# Altium project WG-JW-MB.PrjPCB
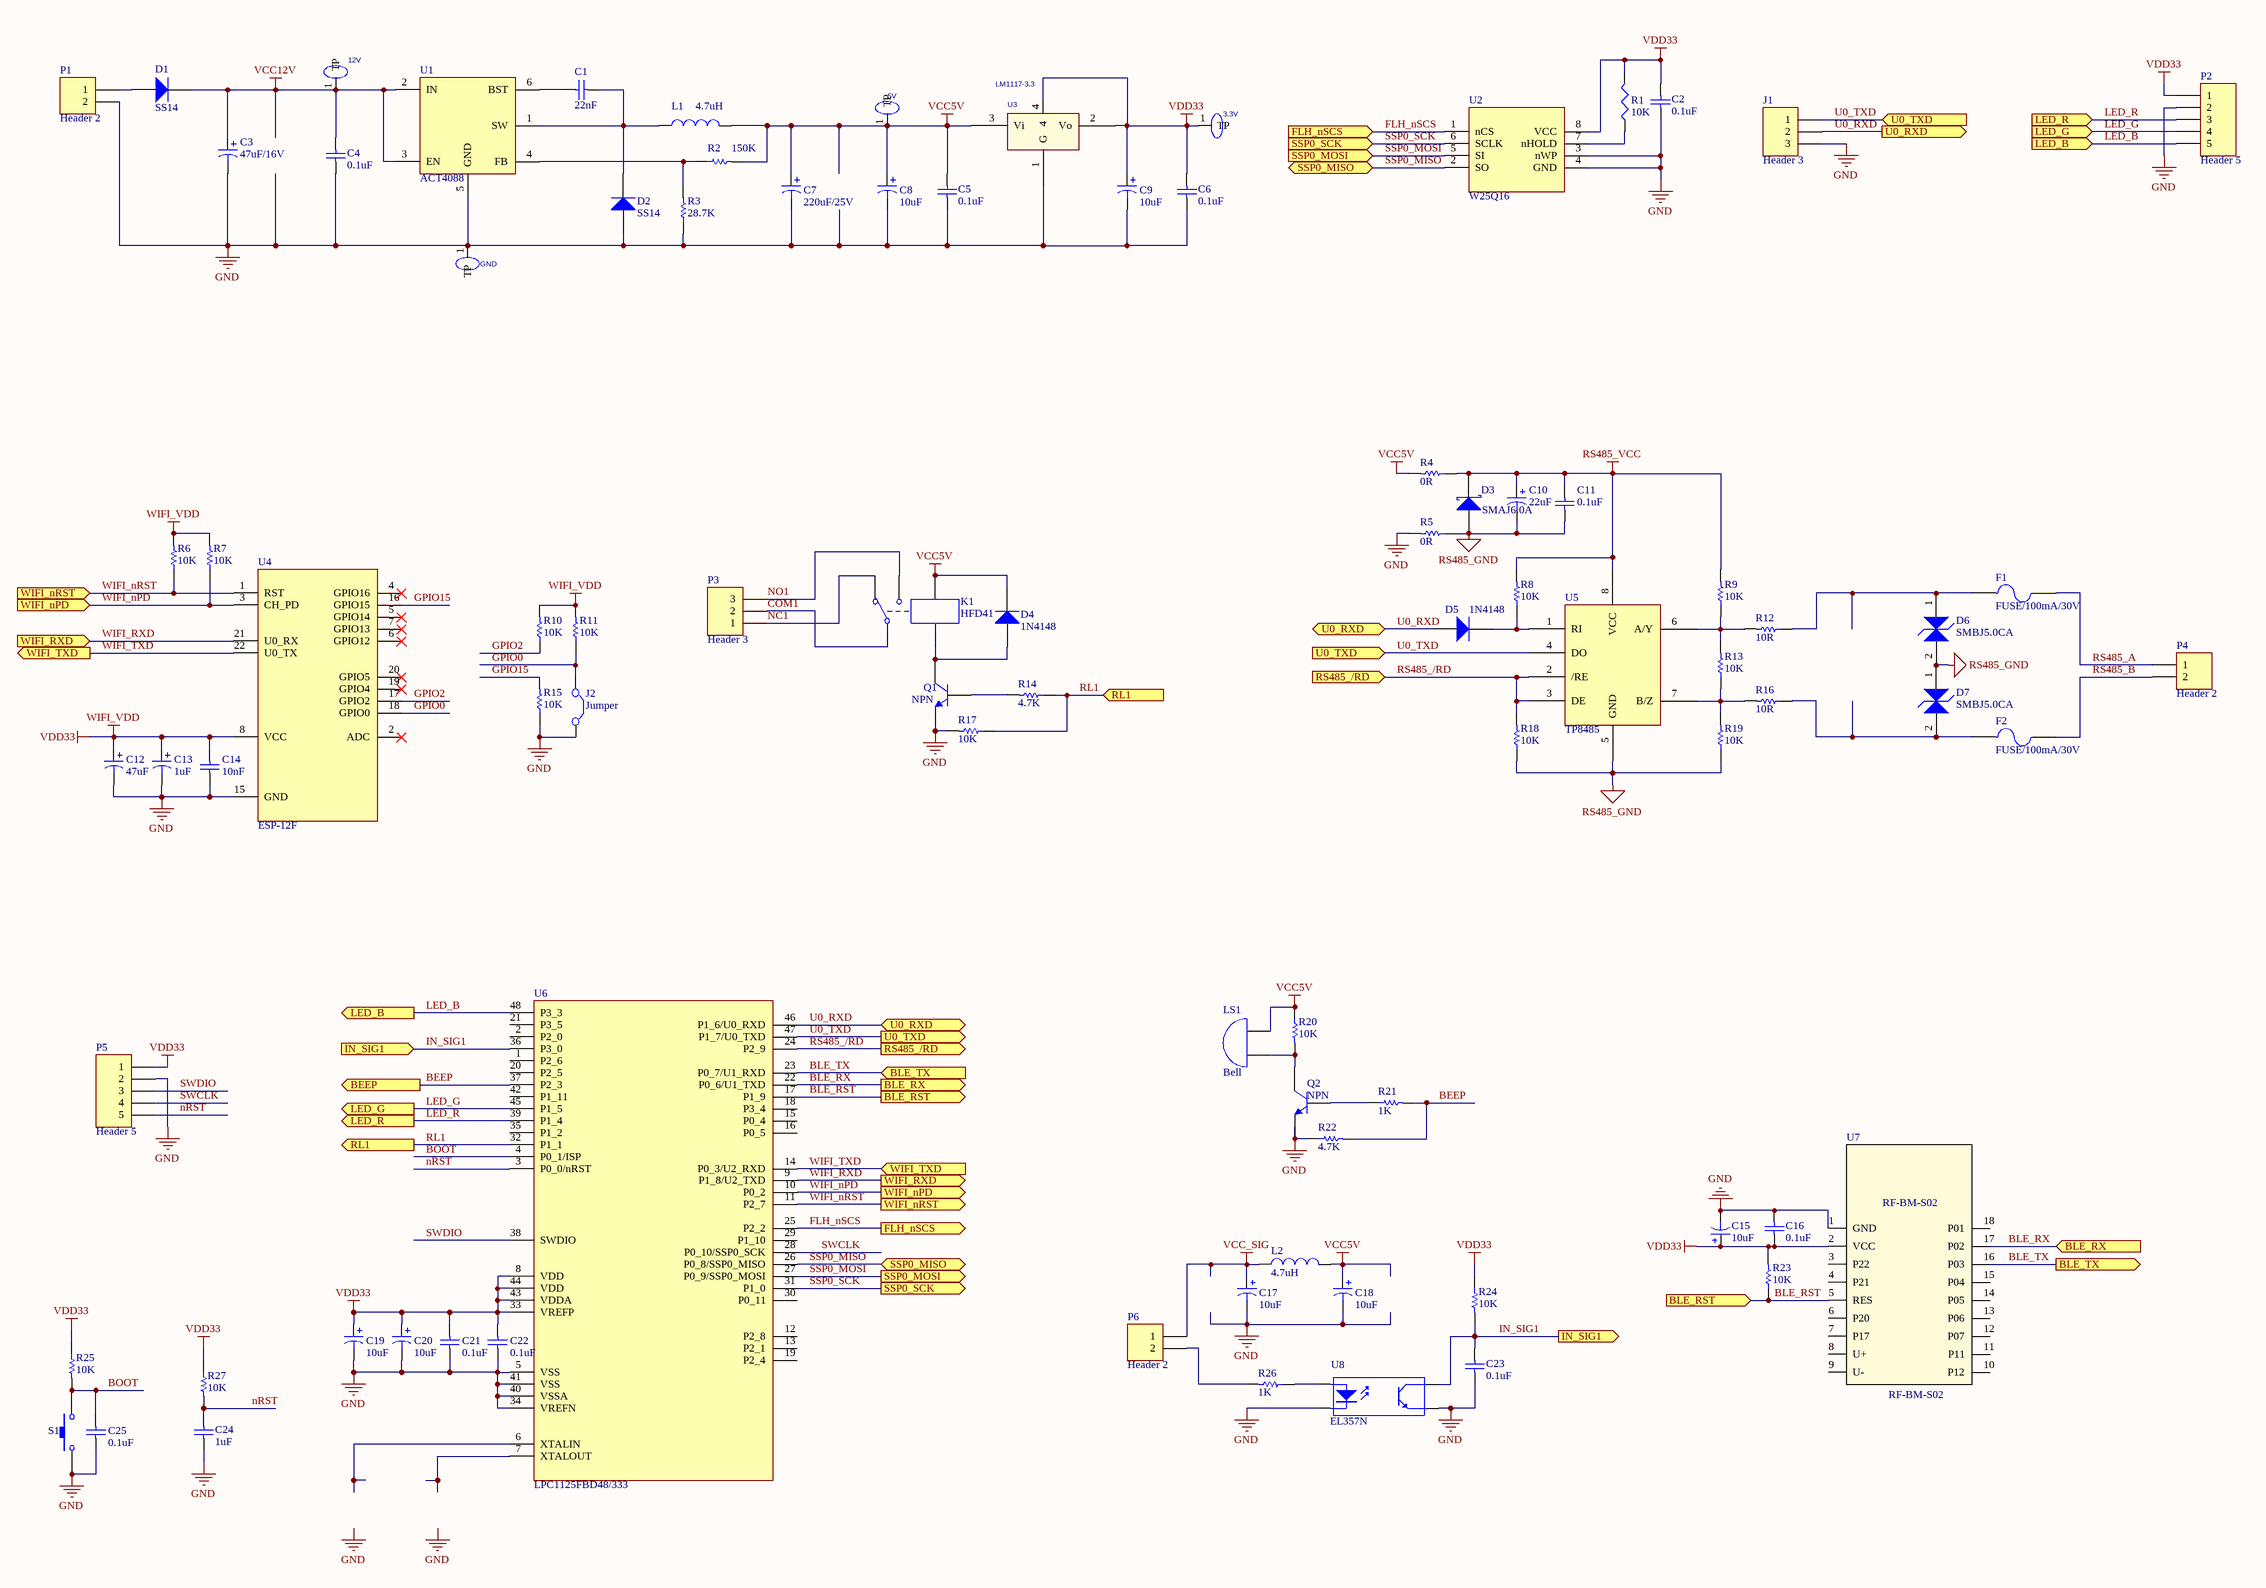
[diagram p0: WG-JW-MB.SchDoc]
1 sheet, 88 parts. Net scope: flat (ports and power ports of the same name join across sheets).
Board file: WG-JW-MB V1.0.PcbDoc

## Sheet WG-JW-MB.SchDoc
size C

### Parts
3.3V  5VOUT  [TestPoint]  (value not drawn)
5V  5VOUT  [TestPoint]  (value not drawn)
12V  5VOUT  [TestPoint]  (value not drawn)
C1  22nF  [0805 - C]
C2  0.1uF  [0805 - C]
C3  47uF/16V  [smd_ec_d5.2]
C4  0.1uF  [0805 - C]
C5  0.1uF  [0805 - C]
C6  0.1uF  [0805 - C]
C7  220uF/25V  [smd_ec_d8]
C8  10uF  [0805 - C]
C9  10uF  [0805 - C]
C10  22uF  [0805 - C]
C11  0.1uF  [0805 - C]
C12  47uF  [SMD_EC_D5.2]
C13  1uF  [0805 - C]
C14  10nF  [0805 - C]
C15  10uF  [0805 - C]
C16  0.1uF  [0805 - C]
C17  10uF  [0805 - C]
C18  10uF  [0805 - C]
C19  10uF  [0805 - C]
C20  10uF  [0805 - C]
C21  0.1uF  [0805 - C]
C22  0.1uF  [0805 - C]
C23  0.1uF  [0805 - C]
C24  1uF  [0805 - C]
C25  0.1uF  [0805 - C]
D1  SS14  [SMD_DIODE_SMA]
D2  SS14  [SMD_DIODE_SMA]
D3  SMAJ6.0A  [SMAJ_A]
D4  1N4148  [1n4148]
D5  1N4148  [1n4148]
D6  SMBJ5.0CA  [SMBJ_CA]
D7  SMBJ5.0CA  [SMBJ_CA]
F1  FUSE/100mA/30V  [SMD_POLYSWITCH]
F2  FUSE/100mA/30V  [SMD_POLYSWITCH]
GND  5VOUT  [TestPoint]  (value not drawn)
J1  Header 3  [HDR1X3]
J2  Jumper  [HDR1X2]
K1  HFD41  [HFD23]
L1  4.7uH  [SMD_L_3015]
L2  4.7uH  [SMD_L_3015]
LS1  Bell  [BZ_D12]
P1  Header 2  [CON2-5.08]
P2  Header 5  [CN_1X5_P200]
P3  Header 3  [CN_1X3_P200]
P4  Header 2  [cn_1x2_p200]
P5  Header 5  [CN_1X5_P200]
P6  Header 2  [CN_1X2_P200]
Q1  NPN  [SOT23]
Q2  NPN  [SOT23]
R1  10K  [0805 - R]
R2  150K  [0805 - R]
R3  28.7K  [0805 - R]
R4  0R  [0805 - R]
R5  0R  [0805 - R]
R6  10K  [0805 - R]
R7  10K  [0805 - R]
R8  10K  [0805 - R]
R9  10K  [0805 - R]
R10  10K  [0805 - R]
R11  10K  [0805 - R]
R12  10R  [0805 - R]
R13  10K  [0805 - R]
R14  4.7K  [0805 - R]
R15  10K  [0805 - R]
R16  10R  [0805 - R]
R17  10K  [0805 - R]
R18  10K  [0805 - R]
R19  10K  [0805 - R]
R20  10K  [0805 - R]
R21  1K  [0805 - R]
R22  4.7K  [0805 - R]
R23  10K  [0805 - R]
R24  10K  [0805 - R]
R25  10K  [0805 - R]
R26  1K  [0805 - R]
R27  10K  [0805 - R]
S1  SW-PB  [SW_SMD_2P]  (value not drawn)
U1  ACT4088  [SOT23-6]
U2  W25Q16  [SOIC8-50X204]
U3  LM1117-3.3  [SOT223]
U4  ESP-12F  [WIFI-ESP]
U5  TP8485  [SOIC8-50X204]
U6  LPC1125FBD48/333  [TQFP48]
U7  RF-BM-S02  [RF-BM-S02]
U8  EL357N  [SOP4]

### Ports
BEEP (out), BLE_RST (in), BLE_RST (out), BLE_RX (in), BLE_RX (out), BLE_TX (in), BLE_TX (out), FLH_nSCS (in), FLH_nSCS (out), IN_SIG1 (in), IN_SIG1 (out), LED_B (in), LED_B (out), LED_G (in), LED_G (out), LED_R (in), LED_R (out), RL1 (in), RL1 (out), RS485_/RD (in), RS485_/RD (out), SSP0_MISO, SSP0_MOSI (in), SSP0_MOSI (out), SSP0_SCK (in), SSP0_SCK (out), U0_RXD, U0_RXD (out), U0_TXD (in), U0_TXD (out), WIFI_nPD (in), WIFI_nPD (out), WIFI_nRST (in), WIFI_nRST (out), WIFI_RXD (in), WIFI_RXD (out), WIFI_TXD (in), WIFI_TXD (out)

### Nets
GND: C2.1 C3.2 C4.1 C5.1 C6.1 C7.2 C8.2 C9.2 C12.2 C13.2 C14.1 C15.2 C16.2 C17.2 C18.2 C19.2 C20.2 C21.1 C22.1 C23.1 C24.1 C25.1 D2.1(A) GND.1(TP) J1.3 J2.2(C2) P1.2 P2.2 P5.2 Q1.3(E) Q2.3(E) R3.1 R5.2 R15.1 R17.2 R22.1 S1.1 U1.5(GND) U2.3(nWP) U2.4(GND) U3.1(G) U4.15(GND) U6.5(VSS) U6.34(VREFN) U6.40(VSSA) U6.41(VSS) U7.1(GND) U8.2(K) U8.3(E)
RS485_GND: C10.2 C11.2 D3.1(A) D6.2 D7.1 R5.1 R18.1 R19.1 U5.5(GND)
RS485_VCC: C10.1 C11.1 D3.2(K) R4.1 R8.2 R9.2 U5.8(VCC)
VCC5V: 5V.1(TP) C5.2 C7.1 C8.1 C18.1 D4.2(K) K1.5 L1.2 L2.2 LS1.1(A) R2.2 R4.2 R20.1 U3.3(Vi)
VCC12V: 12V.1(TP) C3.1 C4.2 D1.2(K) U1.2(IN) U1.3(EN)
VCC_SIG: C17.1 L2.1 P6.1
VDD33: 3.3V.1(TP) C2.2 C6.2 C9.1 C12.1 C13.1 C14.2 C15.1 C16.1 C19.1 C20.1 C21.2 C22.2 P2.1 P5.1 R1.2 R6.2 R7.2 R10.2 R11.2 R23.2 R24.1 R25.1 R27.1 U2.8(VCC) U3.2(Vo) U3.4 U4.8(VCC) U6.8(VDD) U6.33(VREFP) U6.43(VDDA) U6.44(VDD) U7.2(VCC)  [also labelled WIFI_VDD]
BEEP: R21.2 R22.2 U6.37(P2_3) ; port BEEP
BLE_RST: R23.1 U6.17(P1_9) U7.5(RES) ; port BLE_RST
BLE_RX: U6.22(P0_6/U1_TXD) U7.17(P02) ; port BLE_RX
BLE_TX: U6.23(P0_7/U1_RXD) U7.16(P03) ; port BLE_TX
BOOT: C25.2 R25.2 S1.2 U6.4(P0_1/ISP)
COM1: K1.1 P3.2
FLH_nSCS: U2.1(nCS) U6.25(P2_2) ; port FLH_nSCS
GPIO0: J2.1(C1) R11.1 U4.18(GPIO0)
GPIO2: R10.1 U4.17(GPIO2)
GPIO15: R15.2 U4.16(GPIO15)
IN_SIG1: C23.2 R24.2 U6.36(P3_0) U8.4(C) ; port IN_SIG1
LED_B: P2.5 U6.48(P3_3) ; port LED_B
LED_G: P2.4 U6.45(P1_5) ; port LED_G
LED_R: P2.3 U6.39(P1_4) ; port LED_R
NC1: K1.2 P3.1
NO1: K1.3 P3.3
nRST: C24.2 P5.5 R27.2 U6.3(P0_0/nRST)
RL1: R14.1 R17.1 U6.32(P1_1) ; port RL1
RS485_/RD: R18.2 U5.2(/RE) U5.3(DE) U6.24(P2_9) ; port RS485_/RD
RS485_A: F1.2 P4.1
RS485_B: F2.2 P4.2
SSP0_MISO: U2.2(SO) U6.26(P0_8/SSP0_MISO) ; port SSP0_MISO
SSP0_MOSI: U2.5(SI) U6.27(P0_9/SSP0_MOSI) ; port SSP0_MOSI
SSP0_SCK: U2.6(SCLK) U6.31(P1_0) ; port SSP0_SCK
SWCLK: P5.4 U6.28(P0_10/SSP0_SCK)
SWDIO: P5.3 U6.38(SWDIO)
U0_RXD: D5.1(A) J1.2 U6.46(P1_6/U0_RXD) ; port U0_RXD
U0_TXD: J1.1 U5.4(DO) U6.47(P1_7/U0_TXD) ; port U0_TXD
WIFI_nPD: R7.1 U4.3(CH_PD) U6.10(P0_2) ; port WIFI_nPD
WIFI_nRST: R6.1 U4.1(RST) U6.11(P2_7) ; port WIFI_nRST
WIFI_RXD: U4.21(U0_RX) U6.9(P1_8/U2_TXD) ; port WIFI_RXD
WIFI_TXD: U4.22(U0_TX) U6.14(P0_3/U2_RXD) ; port WIFI_TXD
NetC1_1: C1.1 D2.2(K) L1.1 U1.1(SW)
NetC1_2: C1.2 U1.6(BST)
NetD1_1: D1.1(A) P1.1
NetD4_1: D4.1(A) K1.4 Q1.1(C)
NetD5_2: D5.2(K) R8.1 U5.1(RI)
NetD6_1: D6.1 F1.1 R12.1
NetD7_2: D7.2 F2.1 R16.1
NetLS1_2: LS1.2(B) Q2.1(C) R20.2
NetP6_2: P6.2 R26.2
NetQ1_2: Q1.2(B) R14.2
NetQ2_2: Q2.2(B) R21.1
NetR1_1: R1.1 U2.7(nHOLD)
NetR2_1: R2.1 R3.2 U1.4(FB)
NetR9_1: R9.1 R12.2 R13.2 U5.6(A/Y)
NetR13_1: R13.1 R16.2 R19.2 U5.7(B/Z)
NetR26_1: R26.1 U8.1(A)

Not connected (* = marked no-connect by the designer): U4 2(ADC)* 4(GPIO16)* 5(GPIO14)* 6(GPIO12)* 7(GPIO13)* 19(GPIO4)* 20(GPIO5)*; U6 1(P2_6) 2(P2_0) 6(XTALIN) 7(XTALOUT) 12(P2_8) 13(P2_1) 15(P0_4) 16(P0_5) 18(P3_4) 19(P2_4) 20(P2_5) 21(P3_5) 29(P1_10) 30(P0_11) 35(P1_2) 42(P1_11); U7 3(P22) 4(P21) 6(P20) 7(P17) 8(U+) 9(U-) 10(P12) 11(P11) 12(P07) 13(P06) 14(P05) 15(P04) 18(P01)

### Notes on the sheet
- Labels drawn without touching a wire or pin: GND

### Library data of the parts
3.3V 5V 12V GND = TESTPOINT
C1 C2 C4-C6 C11 C14 C16 C21-C25 = Cap: Capacitor; Value: 100pF; Published: 8-Jun-2000; LatestRevisionDate: 17-Jul-2002; LatestRevisionNote: Re-released for DXP Platform.; PackageReference: RAD-0.3; Publisher: Altium Limited; PackageDescription: Radial Cap, Thru-Hole; 2 Leads; 0.3 in Pin Spacing
C3 C7-C10 C12 C13 C15 C17-C20 = Cap Pol1: Polarized Capacitor (Radial); Value: 100pF; Published: 8-Jun-2000; LatestRevisionDate: 17-Jul-2002; LatestRevisionNote: Re-released for DXP Platform.; PackageReference: RB7.6-15; Publisher: Altium Limited; PackageDescription: Polarized Capacitor (Radial); 2 Leads
D1 D2 D4 D5 = Diode: Default Diode; Published: 8-Jun-2000; LatestRevisionDate: 17-Jul-2002; LatestRevisionNote: Re-released for DXP Platform.; PackageVersion: Sep-1996; PackageReference: SMC; Publisher: Altium Limited; PackageDescription: DO-214-AB/SMC; 2 C-Bend Leads; Body 7.9 x 5.9 mm, inc. leads (LxW); Code_JEDEC: DO-214-AB
D3 = D Schottky: Schottky Diode; Published: 8-Jun-2000; LatestRevisionDate: 17-Jul-2002; LatestRevisionNote: Re-released for DXP Platform.; PackageReference: SMB; Publisher: Altium Limited; PackageDescription: DO-214-AA/SMB; 2 C-Bend Leads; Body 5.3 x 3.6 mm, inc. leads (LxW); Code_JEDEC: DO-214-AA
D6 D7 = TVS
F1 F2 = Fuse 2: Fuse; Published: 8-Jun-2000; LatestRevisionDate: 17-Jul-2002; LatestRevisionNote: Re-released for DXP Platform.; PackageReference: PIN-W2/E2.8; Publisher: Altium Limited; PackageDescription: Thru-Hole; 2 Leads
J1 P3 = Header 3: Header, 3-Pin; LatestRevisionDate: 17-Jul-2002; LatestRevisionNote: Re-released for DXP Platform.; Publisher: Altium Limited
J2 = Jumper: Jumper Wire; Published: 24-Mar-1999; LatestRevisionDate: 17-Jul-2002; LatestRevisionNote: Re-released for DXP Platform.; PackageReference: RAD-0.2; Publisher: Altium Limited; PackageDescription: Radial Cap, Thru-Hole; 2 Leads; 0.2 in Pin Spacing
K1 = Relay-SPDT: Single-Pole Dual-Throw Relay; Published: 24-Mar-1999; LatestRevisionDate: 17-Jul-2002; LatestRevisionNote: Re-released for DXP Platform.; PackageReference: MODULE5B; Publisher: Altium Limited
L1 L2 = Inductor: Code_IEC: 1005; Value: 10mH; Published: 8-Jun-2000; LatestRevisionDate: 29-May-2009; LatestRevisionNote: IPC-7351 Footprint Added.; PackageReference: 0402-A; Publisher: Altium Limited; PackageDescription: Chip Inductor; Code_JEITA: 0402
LS1 = Bell: Electrical Bell; Published: 24-Mar-1999; LatestRevisionDate: 17-Jul-2002; LatestRevisionNote: Re-released for DXP Platform.; PackageReference: PIN2; Publisher: Altium Limited
P1 P4 P6 = Header 2: Header, 2-Pin; LatestRevisionDate: 17-Jul-2002; LatestRevisionNote: Re-released for DXP Platform.; Publisher: Altium Limited
P2 P5 = Header 5: Header, 5-Pin; LatestRevisionDate: 17-Jul-2002; LatestRevisionNote: Re-released for DXP Platform.; Publisher: Altium Limited
Q1 Q2 = NPN: NPN Bipolar Transistor; Published: 8-Jun-2000; LatestRevisionDate: 17-Jul-2002; LatestRevisionNote: Re-released for DXP Platform.; PackageReference: TO-226-AA; Publisher: Altium Limited; PackageDescription: TO, Flat Index; 3 In-Line, Axial Leads; Body Dia. 4.8mm; Leads 0.55 x 0.51 mm (max); Code_JEDEC: TO-226-AA
R1 = Res3: Resistor; Value: 1K; Published: 8-Jun-2000; LatestRevisionDate: 29-May-2009; LatestRevisionNote: IPC-7351 Footprint Added.; PackageReference: J1-0603; Publisher: Altium Limited; PackageDescription: Chip Resistor
R2-R20 R22-R25 R27 = Res1: Resistor; Value: 1K; Published: 8-Jun-2000; LatestRevisionDate: 17-Jul-2002; LatestRevisionNote: Re-released for DXP Platform.; PackageReference: AXIAL-0.3; Publisher: Altium Limited; PackageDescription: Axial Device, Thru-Hole; 2 Leads; 0.3 in Pin Spacing
R21 R26 = Res1: Resistor; Published: 8-Jun-2000; LatestRevisionDate: 17-Jul-2002; LatestRevisionNote: Re-released for DXP Platform.; PackageReference: AXIAL-0.3; Publisher: Altium Limited; PackageDescription: Axial Device, Thru-Hole; 2 Leads; 0.3 in Pin Spacing; Value: 1K
S1 = SW-PB: Switch; Published: 24-Mar-1999; LatestRevisionDate: 17-Jul-2002; LatestRevisionNote: Re-released for DXP Platform.; PackageReference: SPST-2; Publisher: Altium Limited; PackageDescription: Switch; 2 Leads
U2 = MX25Lxx
U3 = LM1117_1
U8 = Optoisolator1: 4-Pin Phototransistor Optocoupler; Published: 24-Mar-1999; LatestRevisionDate: 04-Mar-2005; LatestRevisionNote: Sch pins 3 & 4 Swapped.; DatasheetVersion: Nov-2003; PackageReference: DIP-4; Publisher: Altium Limited